# EAGLE design w65c265sxb_ym2149 (EAGLE 9.6.2)
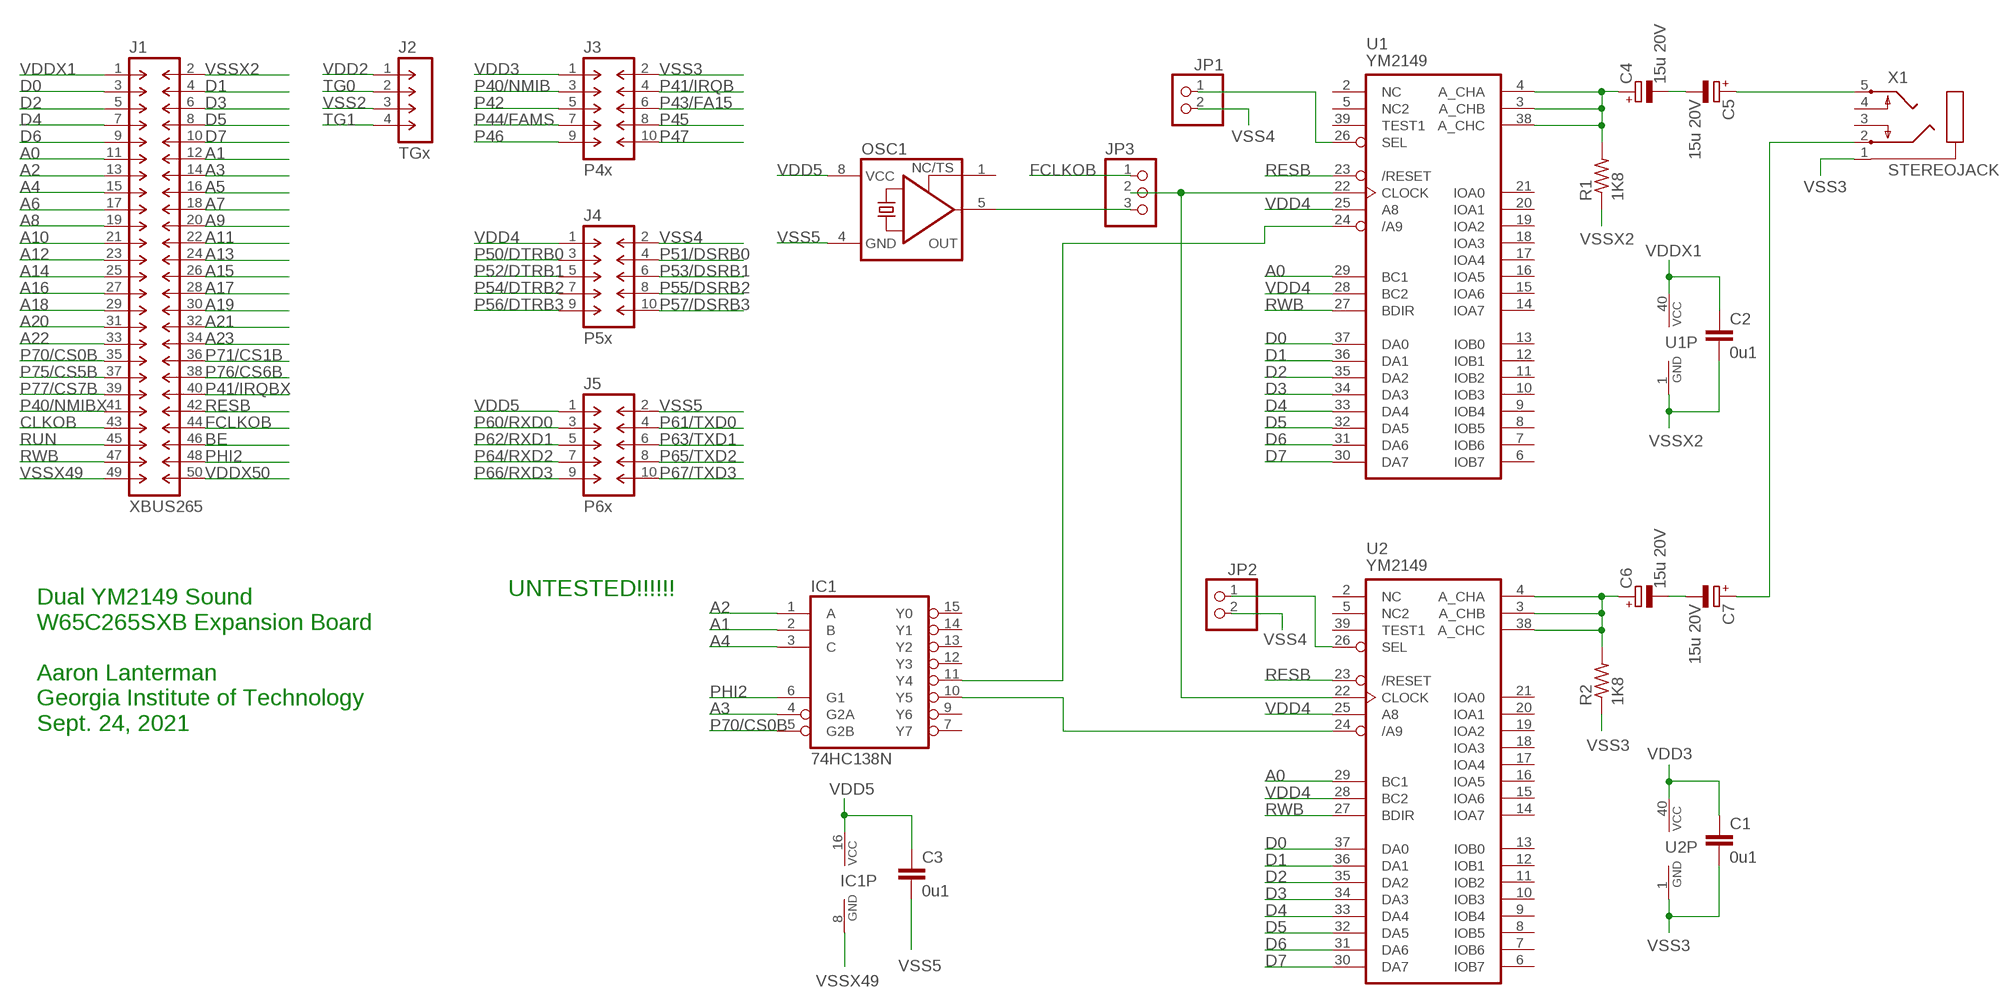
[diagram p0: schematic, sheet 1]

## Parts
C1  0u1  C-EU050-025X075-AARON  [C050-025X075-AARON]
C2  0u1  C-EU050-025X075-AARON  [C050-025X075-AARON]
C3  0u1  C-EU050-025X075-AARON  [C050-025X075-AARON]
C4  15u 20V  CPOL-EUE2.5-7  [E2,5-7]
C5  15u 20V  CPOL-EUE2.5-7  [E2,5-7]
C6  15u 20V  CPOL-EUE2.5-7  [E2,5-7]
C7  15u 20V  CPOL-EUE2.5-7  [E2,5-7]
IC1  74HC138N  [DIL16]
J1  XBUS265  M-2X25-DIL-100  [DIL-100-2X25]
J2  TGx  M-1X04-SIP-100-40  [SIP-100-04-40]
J3  P4x  M-2X05-DIL-100  [DIL-100-2X05]
J4  P5x  M-2X05-DIL-100  [DIL-100-2X05]
J5  P6x  M-2X05-DIL-100  [DIL-100-2X05]
JP1  PINHD-1X2  [1X02]
JP2  PINHD-1X2  [1X02]
JP3  PINHD-1X3  [1X03]
OSC1  XO-8  [DIL08S]
R1  1K8  R-US_0207/10  [0207/10]
R2  1K8  R-US_0207/10  [0207/10]
U1  YM2149  [DIL40]
U2  YM2149  [DIL40]
X1  STEREOJACK  [STX3100]

## Nets
A0: J1.11 U1.29(BC1) U2.29(BC1)
A1: IC1.2(B) J1.12
A2: IC1.1(A) J1.13
A3: IC1.4(G2A) J1.14
A4: IC1.3(C) J1.15
A5: J1.16
A6: J1.17
A7: J1.18
A8: J1.19
A9: J1.20
A10: J1.21
A11: J1.22
A12: J1.23
A13: J1.24
A14: J1.25
A15: J1.26
A16: J1.27
A17: J1.28
A18: J1.29
A19: J1.30
A20: J1.31
A21: J1.32
A22: J1.33
A23: J1.34
BE: J1.46
CLKOB: J1.43
D0: J1.3 U1.37(DA0) U2.37(DA0)
D1: J1.4 U1.36(DA1) U2.36(DA1)
D2: J1.5 U1.35(DA2) U2.35(DA2)
D3: J1.6 U1.34(DA3) U2.34(DA3)
D4: J1.7 U1.33(DA4) U2.33(DA4)
D5: J1.8 U1.32(DA5) U2.32(DA5)
D6: J1.9 U1.31(DA6) U2.31(DA6)
D7: J1.10 U1.30(DA7) U2.30(DA7)
FCLKOB: J1.44 JP3.1
N$5: JP1.1 U1.26(SEL)
N$6: JP3.2 U1.22(CLOCK) U2.22(CLOCK)
N$7: JP3.3 OSC1.5(OUT)
N$8: IC1.11(Y4) U1.24(/A9)
N$9: IC1.10(Y5) U2.24(/A9)
N$10: C4.+ R1.2 U1.3(A_CHB) U1.4(A_CHA) U1.38(A_CHC)
N$11: C6.+ R2.2 U2.3(A_CHB) U2.4(A_CHA) U2.38(A_CHC)
N$12: JP2.1 U2.26(SEL)
N$13: C4.- C5.-
N$14: C6.- C7.-
N$15: C5.+ X1.5
N$16: C7.+ X1.2
P40/NMIB: J3.3
P40/NMIBX: J1.41
P41/IRQB: J3.4
P41/IRQBX: J1.40
P42: J3.5
P43/FA15: J3.6
P44/FAMS: J3.7
P45: J3.8
P46: J3.9
P47: J3.10
P50/DTRB0: J4.3
P51/DSRB0: J4.4
P52/DTRB1: J4.5
P53/DSRB1: J4.6
P54/DTRB2: J4.7
P55/DSRB2: J4.8
P56/DTRB3: J4.9
P57/DSRB3: J4.10
P60/RXD0: J5.3
P61/TXD0: J5.4
P62/RXD1: J5.5
P63/TXD1: J5.6
P64/RXD2: J5.7
P65/TXD2: J5.8
P66/RXD3: J5.9
P67/TXD3: J5.10
P70/CS0B: IC1.5(G2B) J1.35
P71/CS1B: J1.36
P75/CS5B: J1.37
P76/CS6B: J1.38
P77/CS7B: J1.39
PHI2: IC1.6(G1) J1.48
RESB: J1.42 U1.23(/RESET) U2.23(/RESET)
RUN: J1.45
RWB: J1.47 U1.27(BDIR) U2.27(BDIR)
TG0: J2.2
TG1: J2.4
VDD2: J2.1
VDD3: C1.1 J3.1 U2.40(VCC)
VDD4: J4.1 U1.25(A8) U1.28(BC2) U2.25(A8) U2.28(BC2)
VDD5: C3.1 IC1.16(VCC) J5.1 OSC1.8(VCC)
VDDX1: C2.1 J1.1 U1.40(VCC)
VDDX50: J1.50
VSS2: J2.3
VSS3: C1.2 J3.2 R2.1 U2.1(GND) X1.1
VSS4: J4.2 JP1.2 JP2.2
VSS5: C3.2 J5.2 OSC1.4(GND)
VSSX2: C2.2 J1.2 R1.1 U1.1(GND)
VSSX49: IC1.8(GND) J1.49
Unconnected: IC1.7(Y7) IC1.9(Y6) IC1.12(Y3) IC1.13(Y2) IC1.14(Y1) IC1.15(Y0) OSC1.1(TS) U1.2(NC) U1.5(NC2) U1.6(IOB7) U1.7(IOB6) U1.8(IOB5) U1.9(IOB4) U1.10(IOB3) U1.11(IOB2) U1.12(IOB1) U1.13(IOB0) U1.14(IOA7) U1.15(IOA6) U1.16(IOA5) U1.17(IOA4) U1.18(IOA3) U1.19(IOA2) U1.20(IOA1) U1.21(IOA0) U1.39(TEST1) U2.2(NC) U2.5(NC2) U2.6(IOB7) U2.7(IOB6) U2.8(IOB5) U2.9(IOB4) U2.10(IOB3) U2.11(IOB2) U2.12(IOB1) U2.13(IOB0) U2.14(IOA7) U2.15(IOA6) U2.16(IOA5) U2.17(IOA4) U2.18(IOA3) U2.19(IOA2) U2.20(IOA1) U2.21(IOA0) U2.39(TEST1) X1.3 X1.4

## Notes on the sheet
- UNTESTED!!!!!!
- Dual YM2149 Sound
  W65C265SXB Expansion Board
  
  Aaron Lanterman
  Georgia Institute of Technology
  Sept. 24, 2021

## Library data of the parts
C1-C3 = aaroncaps:C-EU: CAPACITOR, European symbol
C4-C7 = rcl:CPOL-EU: POLARIZED CAPACITOR, European symbol; SPICEPREFIX: C
IC1 = 74xx-eu:74*138: 3-line to 8-line DECODER/DEMULTIPLEXER
J1 = con-headers-jp:M-2X25-: MALE HEADER
J2 = con-headers-jp:M-1X04-: MALE HEADER
J3-J5 = con-headers-jp:M-2X05-: MALE HEADER
JP1 JP2 = pinhead:PINHD-1X2: PIN HEADER
JP3 = pinhead:PINHD-1X3: PIN HEADER
OSC1 = crystal:XO-: CRYSTAL; OC_FARNELL: unknown; OC_NEWARK: unknown
R1 R2 = rcl:R-US_: RESISTOR, American symbol; SPICEPREFIX: R
U1 U2 = 1987computer:YM2149: Programmable sound generator
X1 = adafruit:STEREOJACK: MIC/HEADPHONE JACK Stereo jack with two switches. Kycon STX3100, CUI SJ1-3555NG and/or 4UCon 05544

## Board
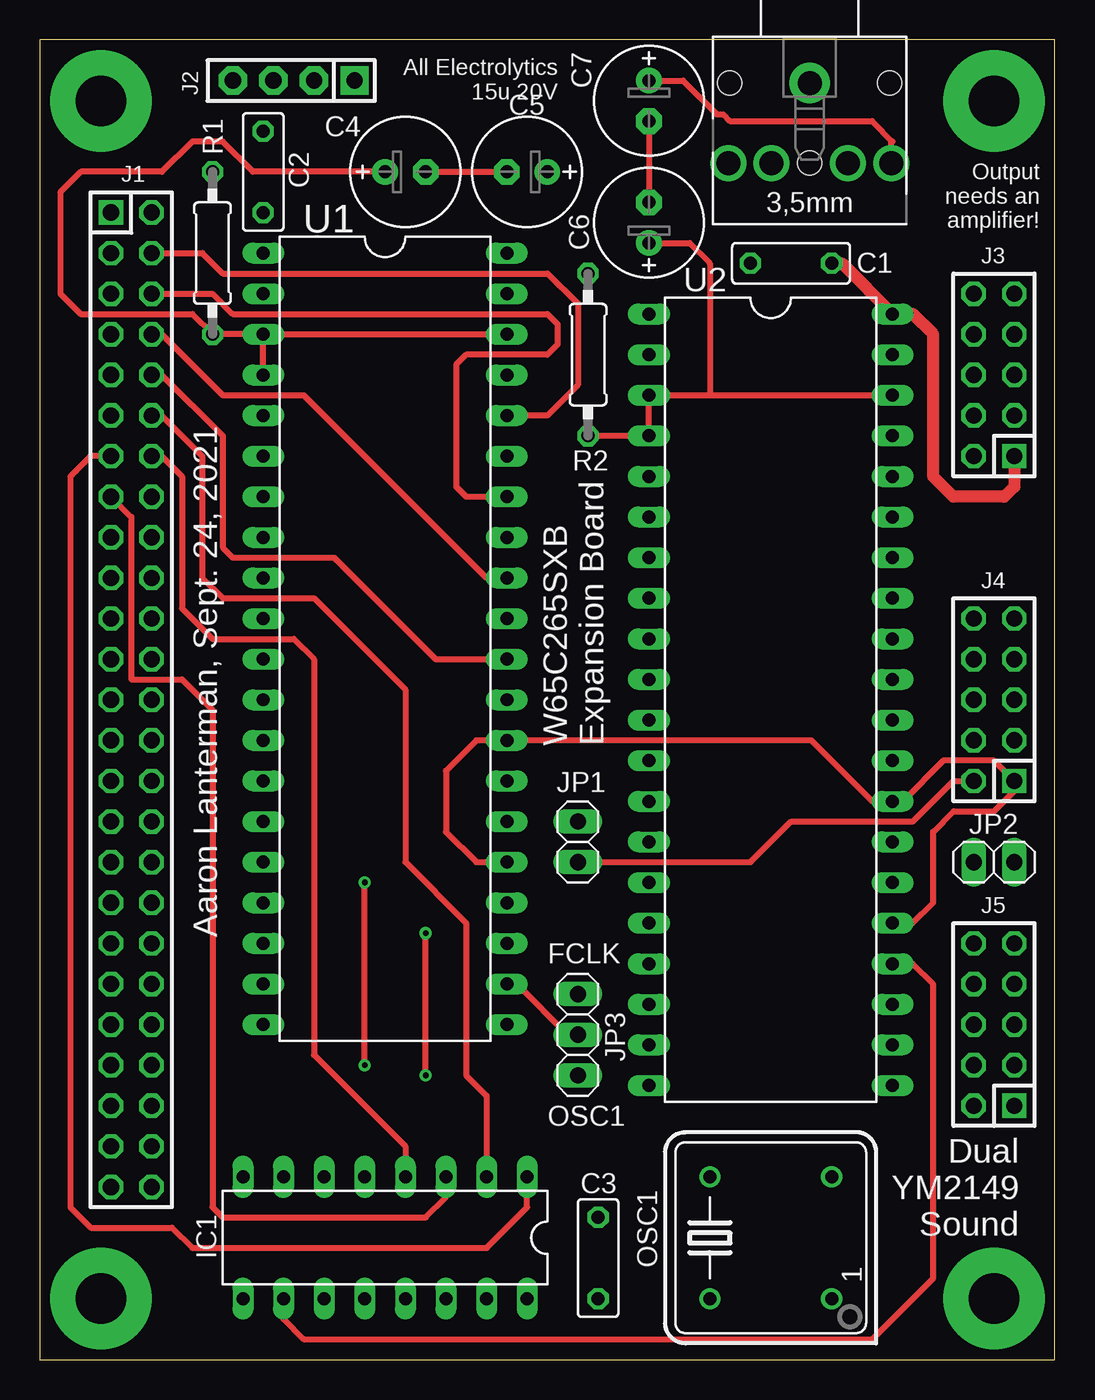
[diagram p1: board, top side]
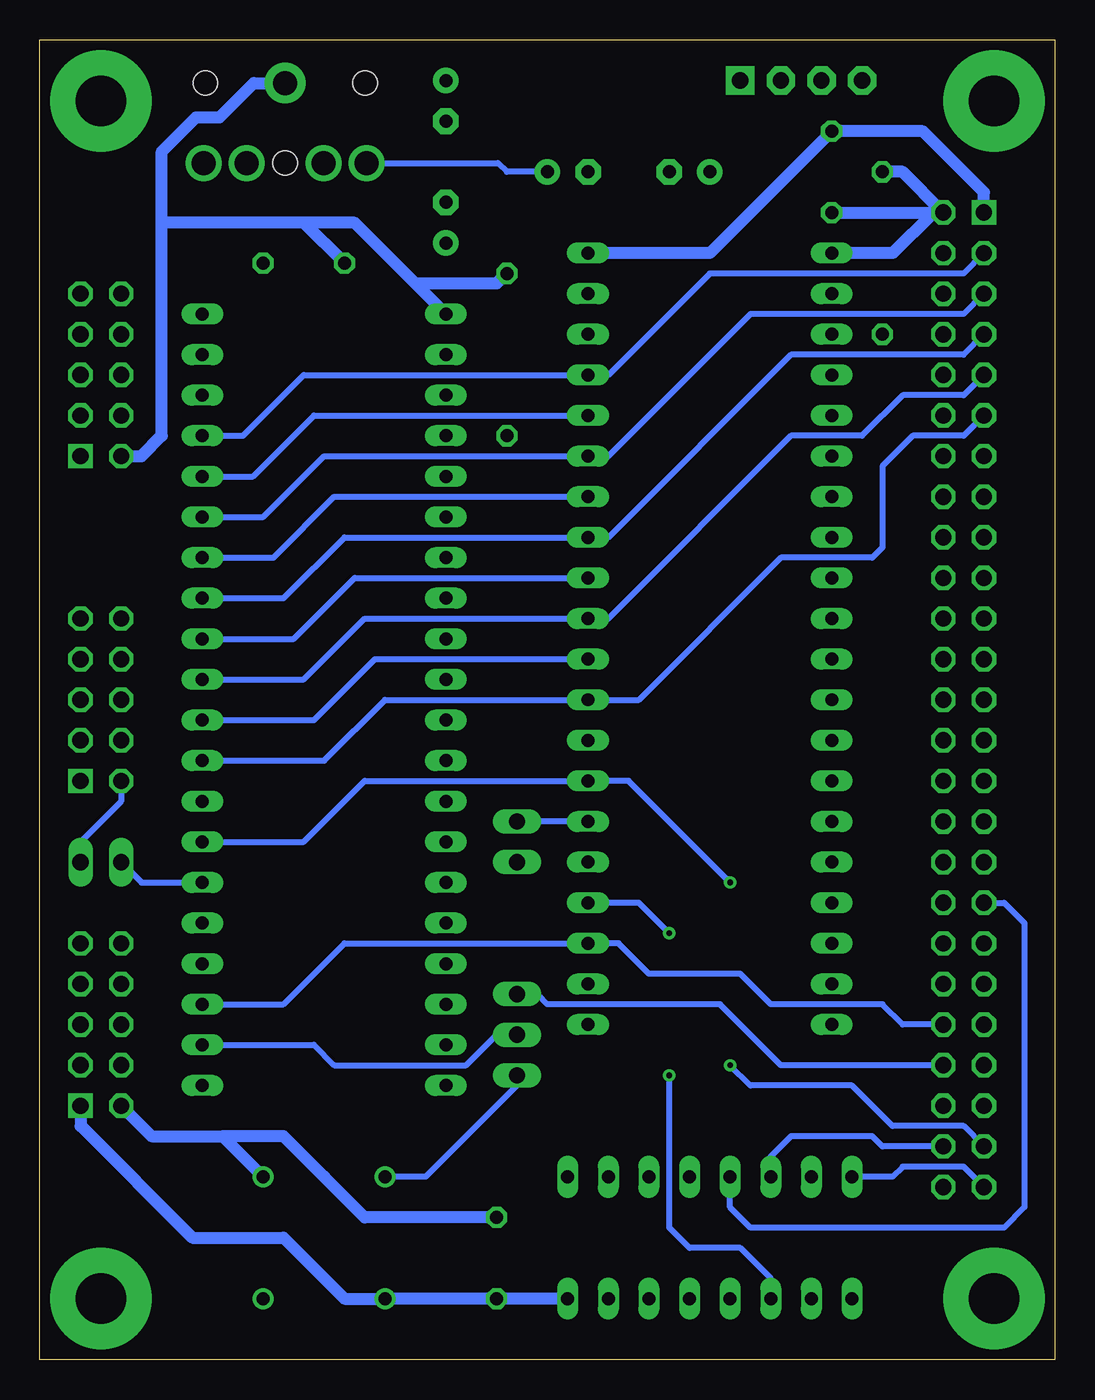
[diagram p2: board, bottom side, seen from below]

Size 63.5 x 82.55 mm. Coordinates in mm from the lower left corner, seen from the top.
Outline: 0,0 63.5,0 63.5,82.55 0,82.55 0,0
Copper layers (1*16): Top 0.035mm / dielectric 1.5mm / Bottom 0.035mm
Design rules "InventionStudioDesignRules": minimum track width 10mil, minimum drill 0.4mm, track to track 10mil, track to pad 10mil, pad to pad 10mil, via to via 10mil, smd to smd 10mil, copper to edge 40mil, drill to drill 6mil, minimum pad ring 10mil, minimum via ring 8mil, stop-mask expansion 4mil, vias tented up to drill 0mil, thermal gap 10mil

### Footprints (pad centres in the part's own frame; a part is rotated, then mirrored left to right if it is on the bottom)
C050-025X075-AARON = drill 0.813 octagon: 1 -2.54,0; 2 2.54,0
E2,5-7 = drill 0.813 pad 1.6: + -1.27,0 | drill 0.813 pad 1.6 octagon: - 1.27,0
DIL16 = drill 0.813 long: 1 -8.89,-3.81; 2 -6.35,-3.81; 3 -3.81,-3.81; 4 -1.27,-3.81; 5 1.27,-3.81; 6 3.81,-3.81; 7 6.35,-3.81; 8 8.89,-3.81; 9 8.89,3.81; 10 6.35,3.81; 11 3.81,3.81; 12 1.27,3.81; 13 -1.27,3.81; 14 -3.81,3.81; 15 -6.35,3.81; 16 -8.89,3.81
DIL-100-2X25 = drill 1.016 square: 1 -30.48,-1.27 | drill 1.016 octagon: 2 -30.48,1.27; 3 -27.94,-1.27; 4 -27.94,1.27; 5 -25.4,-1.27; 6 -25.4,1.27; 7 -22.86,-1.27; 8 -22.86,1.27; 9 -20.32,-1.27; 10 -20.32,1.27; 11 -17.78,-1.27; 12 -17.78,1.27; 13 -15.24,-1.27; 14 -15.24,1.27; 15 -12.7,-1.27; 16 -12.7,1.27; 17 -10.16,-1.27; 18 -10.16,1.27; 19 -7.62,-1.27; 20 -7.62,1.27; 21 -5.08,-1.27; 22 -5.08,1.27; 23 -2.54,-1.27; 24 -2.54,1.27; 25 0,-1.27; 26 0,1.27; 27 2.54,-1.27; 28 2.54,1.27; 29 5.08,-1.27; 30 5.08,1.27; 31 7.62,-1.27; 32 7.62,1.27; 33 10.16,-1.27; 34 10.16,1.27; 35 12.7,-1.27; 36 12.7,1.27; 37 15.24,-1.27; 38 15.24,1.27; 39 17.78,-1.27; 40 17.78,1.27; 41 20.32,-1.27; 42 20.32,1.27; 43 22.86,-1.27; 44 22.86,1.27; 45 25.4,-1.27; 46 25.4,1.27; 47 27.94,-1.27; 48 27.94,1.27; 49 30.48,-1.27; 50 30.48,1.27
SIP-100-04-40 = drill 1.016 pad 1.778 square: 1 -3.81,0 | drill 1.016 pad 1.778 octagon: 2 -1.27,0; 3 1.27,0; 4 3.81,0
DIL-100-2X05 = drill 1.016 square: 1 -5.08,-1.27 | drill 1.016 octagon: 2 -5.08,1.27; 3 -2.54,-1.27; 4 -2.54,1.27; 5 0,-1.27; 6 0,1.27; 7 2.54,-1.27; 8 2.54,1.27; 9 5.08,-1.27; 10 5.08,1.27
1X02 = drill 1.016 long: 1 -1.27,0; 2 1.27,0
1X03 = drill 1.016 long: 1 -2.54,0; 2 0,0; 3 2.54,0
DIL08S = drill 0.813: 1 -3.81,-3.81; 4 3.81,-3.81; 5 3.81,3.81; 8 -3.81,3.81
0207/10 = drill 0.813 octagon: 1 -5.08,0; 2 5.08,0
DIL40 = drill 0.813 long: 1 -24.13,-7.62; 2 -21.59,-7.62; 3 -19.05,-7.62; 4 -16.51,-7.62; 5 -13.97,-7.62; 6 -11.43,-7.62; 7 -8.89,-7.62; 8 -6.35,-7.62; 9 -3.81,-7.62; 10 -1.27,-7.62; 11 1.27,-7.62; 12 3.81,-7.62; 13 6.35,-7.62; 14 8.89,-7.62; 15 11.43,-7.62; 16 13.97,-7.62; 17 16.51,-7.62; 18 19.05,-7.62; 19 21.59,-7.62; 20 24.13,-7.62; 21 24.13,7.62; 22 21.59,7.62; 23 19.05,7.62; 24 16.51,7.62; 25 13.97,7.62; 26 11.43,7.62; 27 8.89,7.62; 28 6.35,7.62; 29 3.81,7.62; 30 1.27,7.62; 31 -1.27,7.62; 32 -3.81,7.62; 33 -6.35,7.62; 34 -8.89,7.62; 35 -11.43,7.62; 36 -13.97,7.62; 37 -16.51,7.62; 38 -19.05,7.62; 39 -21.59,7.62; 40 -24.13,7.62
STX3100 = drill 1.5 pad 2.54: 1 2.7,-0.1 | drill 1.5: 2 7.7,5; 3 7.7,2.3; 4 7.7,-2.5; 5 7.7,-5.2 | hole 1.5: 2.7,4.9; 2.7,-5.1; 7.7,-0.1

### Placement (x,y rotation side)
C1  46.99,68.58 180 top
C2  13.97,74.3 270 top
C3  34.92,6.35 90 top
C4  22.86,74.3 0 top
C5  30.48,74.3 180 top
C6  38.1,71.12 90 top
C7  38.1,78.74 270 top
IC1  21.59,7.62 180 top
J1  5.71,41.27 270 top
J2  15.88,80.01 180 top
J3  59.69,61.59 90 top
J4  59.69,41.27 90 top
J5  59.69,20.95 90 top
JP1  33.66,32.38 270 top
JP2  59.69,31.11 0 top
JP3  33.66,20.32 270 top
OSC1  45.72,7.62 90 top
R1  10.79,69.22 270 top
R2  34.29,62.87 270 top
U1  21.59,45.09 270 top
U2  45.72,41.27 270 top
X1  48.26,82.55 270 top

### Tracks (layer width: path | path; a pad name or v marks a point on that pad's centre or on a via)
A0
  Bottom 0.381: U2.29 45.72,37.47 41.91,41.27 U1.29 26.04,41.27 17.14,50.16 11.43,50.16 10.79,50.8 10.79,55.88 8.89,57.78 5.71,57.78 J1.11
A1
  Top 0.381: J1.12 7.62,59.05 10.16,56.52 10.16,48.9 11.43,47.62 17.14,47.62 22.86,41.91 22.86,31.11 26.67,27.3 26.67,17.78 27.94,16.51 IC1.2
A2
  Top 0.381: J1.13 3.17,56.52 1.91,55.24 1.91,9.53 3.17,8.26 8.26,8.26 9.53,6.99 27.94,6.99 30.48,9.53 IC1.1
A3
  Top 0.381: J1.14 7.62,56.52 8.89,55.24 8.89,46.99 10.79,45.09 15.88,45.09 17.14,43.81 17.14,19.05 22.86,13.34 IC1.4
A4
  Top 0.381: J1.15 5.71,52.7 5.71,42.55 8.89,42.55 10.79,40.64 10.79,9.53 11.43,8.89 24.13,8.89 25.4,10.16 IC1.3
D0
  Bottom 0.381: U2.37 50.8,57.78 46.99,61.59 U1.37 27.94,61.59 21.59,67.94 5.71,67.94 J1.3
D1
  Top 0.381: J1.4 10.16,69.22 11.43,67.94 31.75,67.94 33.66,66.04 33.66,60.96 31.75,59.05 U1.36
  Bottom 0.381: U2.36 50.16,55.24 46.35,59.05 U1.36
D2
  Bottom 0.381: U2.35 49.53,52.7 45.72,56.52 U1.35 27.94,56.52 19.05,65.41 5.71,65.41 J1.5
D3
  Top 0.381: J1.6 10.79,66.67 12.06,65.41 31.75,65.41 32.38,64.77 32.38,63.5 31.75,62.87 26.67,62.87 26.04,62.23 26.04,54.61 26.67,53.98 U1.34
  Bottom 0.381: U2.34 48.9,50.16 45.09,53.98 U1.34
D4
  Bottom 0.381: U2.33 48.26,47.62 44.45,51.44 U1.33 27.94,51.44 16.51,62.87 5.71,62.87 J1.7
D5
  Top 0.381: U1.32 27.94,48.9 16.51,60.33 11.43,60.33 7.62,64.14 J1.8
  Bottom 0.381: U2.32 47.62,45.09 43.81,48.9 U1.32
D6
  Bottom 0.381: U2.31 46.99,42.55 43.18,46.35 U1.31 27.94,46.35 16.51,57.78 12.06,57.78 9.53,60.33 5.71,60.33 J1.9
D7
  Top 0.381: U1.30 24.77,43.81 18.41,50.16 12.06,50.16 11.43,50.8 11.43,57.78 7.62,61.59 J1.10
  Bottom 0.381: U2.30 46.35,40.01 42.55,43.81 U1.30
FCLKOB
  Bottom 0.381: J1.44 17.14,18.41 20.95,22.23 31.75,22.23 32.38,22.86 JP3.1
N$1  (via drill 3.17 pad 6.35)
  other vias: 3.81,3.81
N$2  (via drill 3.17 pad 6.35)
  other vias: 59.69,3.81
N$3  (via drill 3.17 pad 6.35)
  other vias: 59.69,78.74
N$4  (via drill 3.17 pad 6.35)
  other vias: 3.81,78.74
N$5
  Bottom 0.381: U1.26 JP1.1
N$6
  Top 0.381: U1.22 29.84,23.5 33.02,20.32 JP3.2
  Bottom 0.381: U2.22 46.35,19.68 45.09,18.41 36.83,18.41 34.92,20.32 JP3.2
N$7
  Bottom 0.381: JP3.3 33.66,17.14 39.37,11.43 OSC1.5
N$8  (via drill 0.35)
  Top 0.381: v24.13,17.78 v24.13,26.67
  Bottom 0.381: IC1.11 17.78,5.08 19.68,6.99 22.86,6.99 24.13,8.26 v24.13,17.78 | v24.13,26.67 26.04,28.57 U1.24
N$9
  Top 0.381: IC1.10 15.24,2.54 16.51,1.27 52.07,1.27 55.88,5.08 55.88,23.5 54.61,24.77 U2.24
N$10
  Top 0.381: U1.4 U1.3 | U1.3 R1.2 9.53,65.41 2.54,65.41 1.27,66.67 1.27,73.03 2.54,74.3 7.62,74.3 9.53,76.2 11.43,76.2 13.34,74.3 C4.+ | U1.3 U1.38
N$11
  Top 0.381: R2.2 U2.4 U2.3 41.91,60.33 | 41.91,60.33 U2.38 | C6.+ 40.64,69.85 41.91,68.58 41.91,60.33
N$12
  Bottom 0.381: JP2.1 57.15,29.84 U2.26
N$13
  Top 0.381: C4.- C5.-
N$14
  Top 0.381: C7.- C6.-
N$15
  Bottom 0.381: X1.5 34.84,74.85 34.29,74.3 C5.+
N$16
  Top 0.381: X1.2 53.26,76.12 53.34,76.2 52.07,77.47 43.18,77.47 42.76,77.89 42.35,77.89 40.23,80.01 C7.+
P70/CS0B
  Bottom 0.381: J1.35 3.17,28.57 1.91,27.3 1.91,9.53 3.17,8.26 19.05,8.26 20.32,9.53 IC1.5
PHI2
  Bottom 0.381: J1.48 10.79,13.34 11.43,13.97 16.51,13.97 17.78,12.7 IC1.6
RESB
  Bottom 0.381: U2.23 48.26,22.23 44.45,26.04 U1.23 27.3,26.04 25.4,24.13 19.68,24.13 17.78,22.23 10.79,22.23 9.53,20.95 J1.42
RWB  (via drill 0.35)
  Top 0.381: v20.32,18.41 v20.32,29.84
  Bottom 0.381: U2.27 46.99,32.38 43.18,36.2 U1.27 26.67,36.2 v20.32,29.84 | J1.47 5.71,14.61 10.16,14.61 12.7,17.14 19.05,17.14 v20.32,18.41
VDD3
  Top 0.762: J3.1 60.96,54.61 60.33,53.98 57.15,53.98 55.88,55.24 55.88,64.14 54.61,65.41 U2.40 50.16,68.58 C1.1
VDD4
  Top 0.381: U1.25 27.3,31.11 25.4,33.02 25.4,36.83 27.3,38.73 U1.28 48.26,38.73 52.07,34.92 U2.28 53.98,34.92 56.52,37.47 59.69,37.47 J4.1 60.96,35.56 59.69,34.29 57.15,34.29 55.88,33.02 55.88,28.57 54.61,27.3 U2.25
VDD5
  Bottom 0.762: J5.1 60.96,14.61 53.98,7.62 48.26,7.62 44.45,3.81 OSC1.8 C3.1 IC1.16
VDDX1
  Bottom 0.762: J1.1 4.45,73.03 8.26,76.83 C2.1 21.59,69.22 U1.40
VSS3
  Bottom 0.762: J3.2 57.15,56.52 55.88,57.78 55.88,71.12 | 55.88,71.12 55.88,75.56 53.74,77.7 52.27,77.7 50.12,79.85 X1.1 | C1.2 46.99,71.12 | 46.99,71.12 55.88,71.12 | U2.1 40.01,67.31 | 40.01,67.31 43.81,71.12 46.99,71.12 | R2.1 34.92,67.31 40.01,67.31
VSS4
  Top 0.381: J4.2 57.15,36.2 54.61,33.66 46.99,33.66 44.45,31.11 JP1.2
  Bottom 0.381: J4.2 58.42,34.92 60.96,32.38 JP2.2
VSS5
  Bottom 0.762: J5.2 56.52,13.97 52.07,13.97 | 52.07,13.97 OSC1.4 | C3.2 43.18,8.89 45.72,11.43 48.26,13.97 52.07,13.97
VSSX2
  Bottom 0.762: J1.2 7.62,71.75 10.16,69.22 U1.1 | J1.2 9.53,74.3 R1.1 | C2.2 J1.2
VSSX49
  Bottom 0.381: J1.49 5.71,12.06 9.53,12.06 10.16,11.43 IC1.8

### Text on the board
tNames: All Electrolytics / 15u 20V | Output / needs an / amplifier! | W65C265SXB / Expansion Board | Aaron Lanterman, Sept. 24, 2021 | FCLK | OSC1 | Dual / YM2149 / Sound